# EAGLE board demo_open8 (EAGLE 9.6.2), part 1 of 2
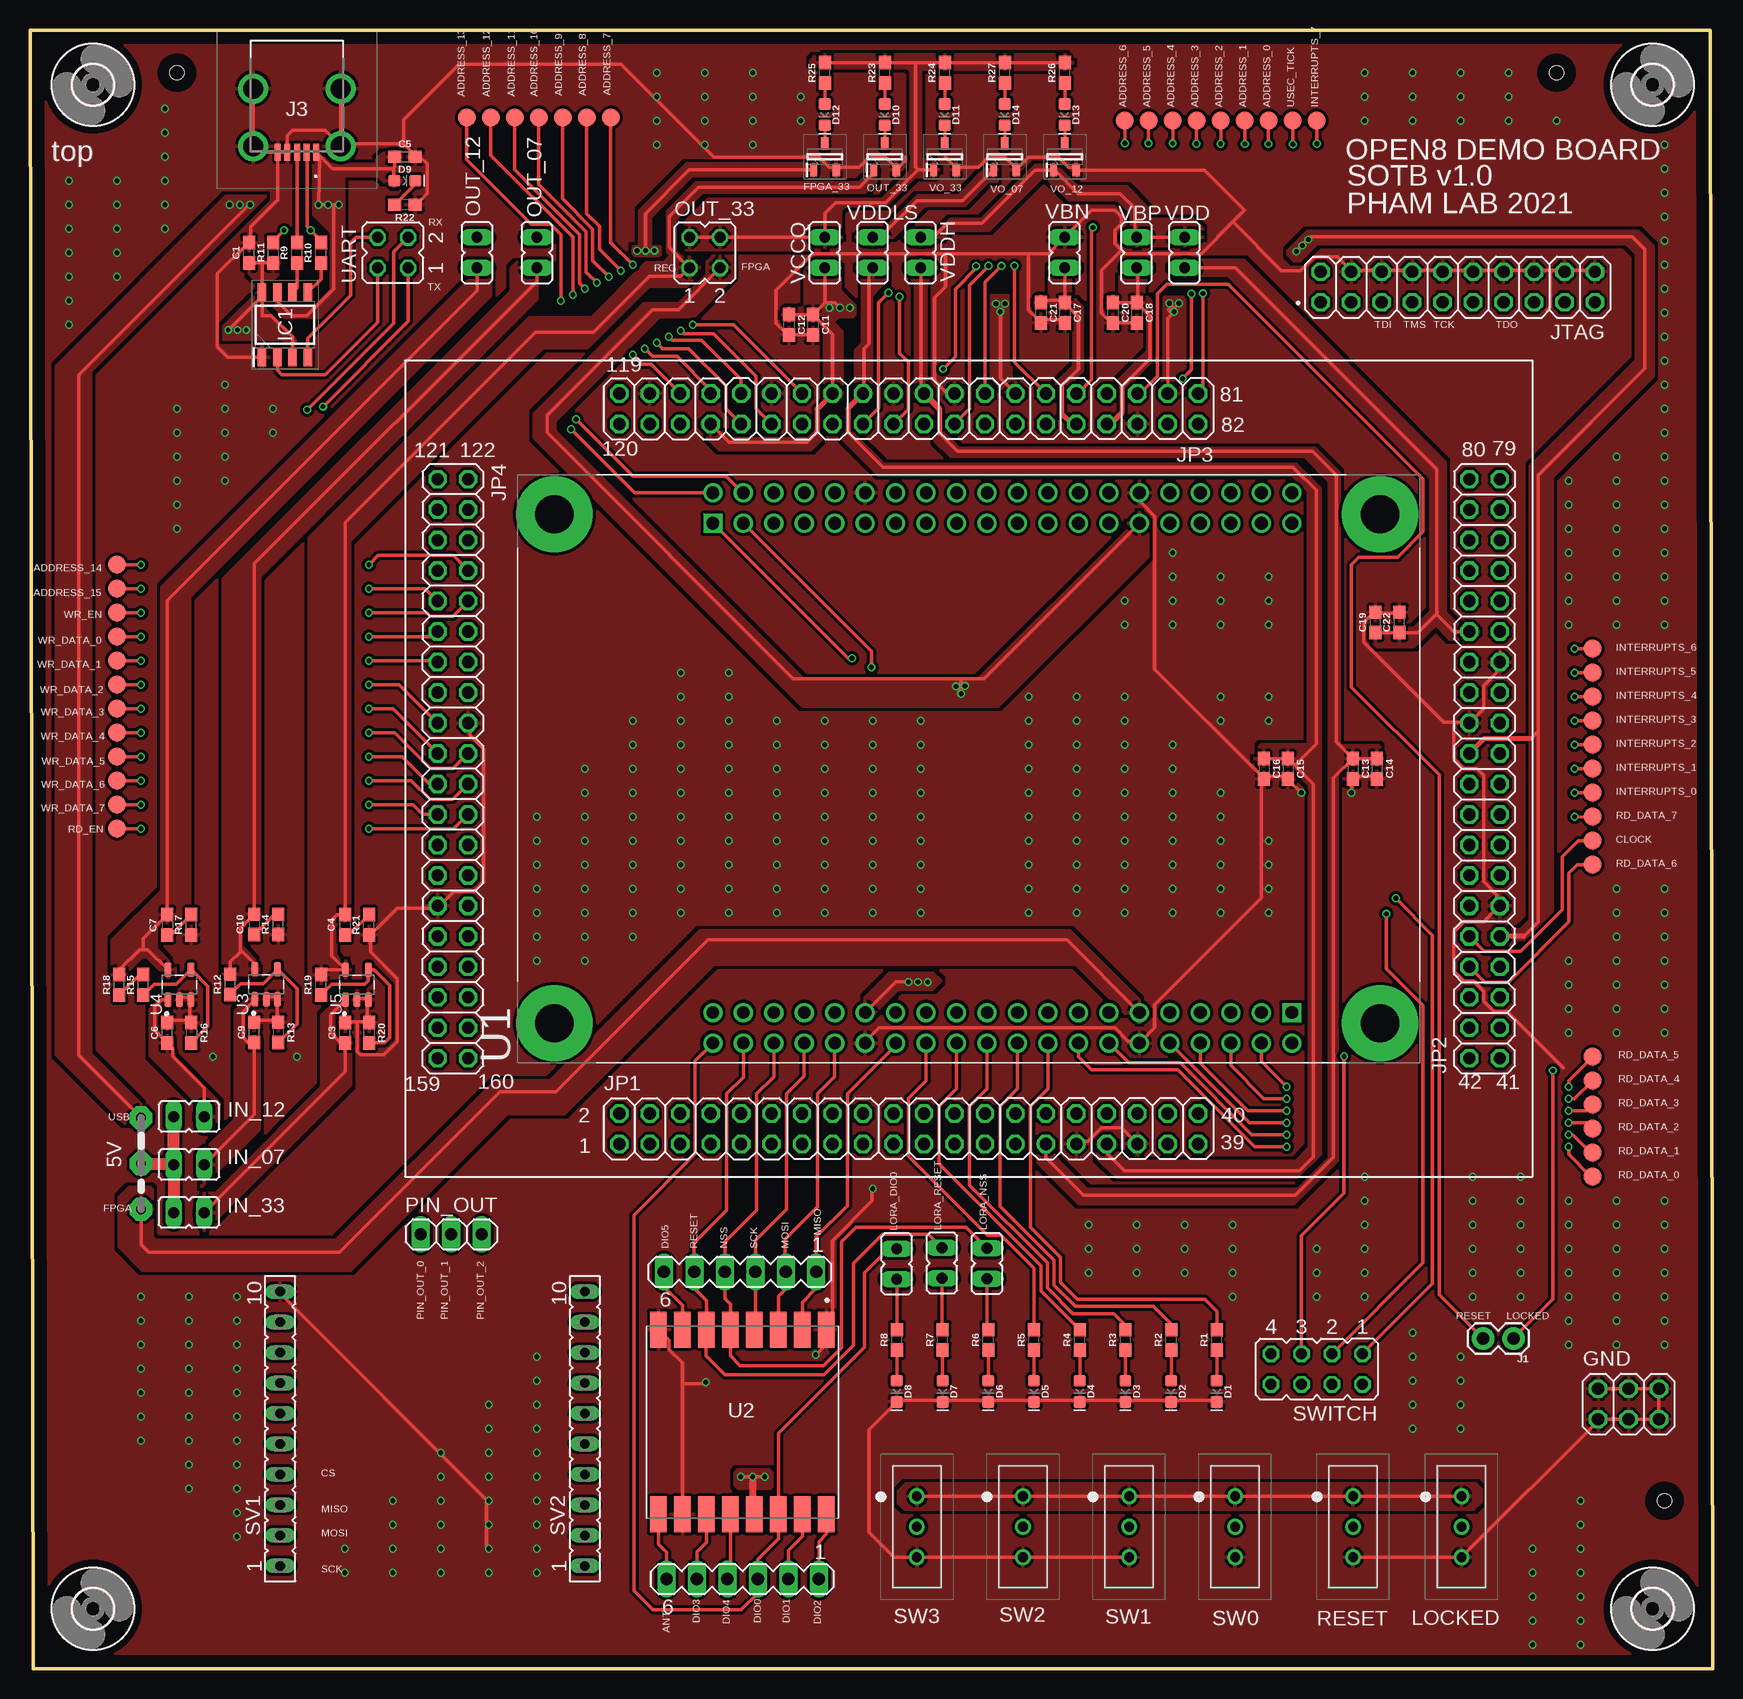
[diagram p2: board, top side]
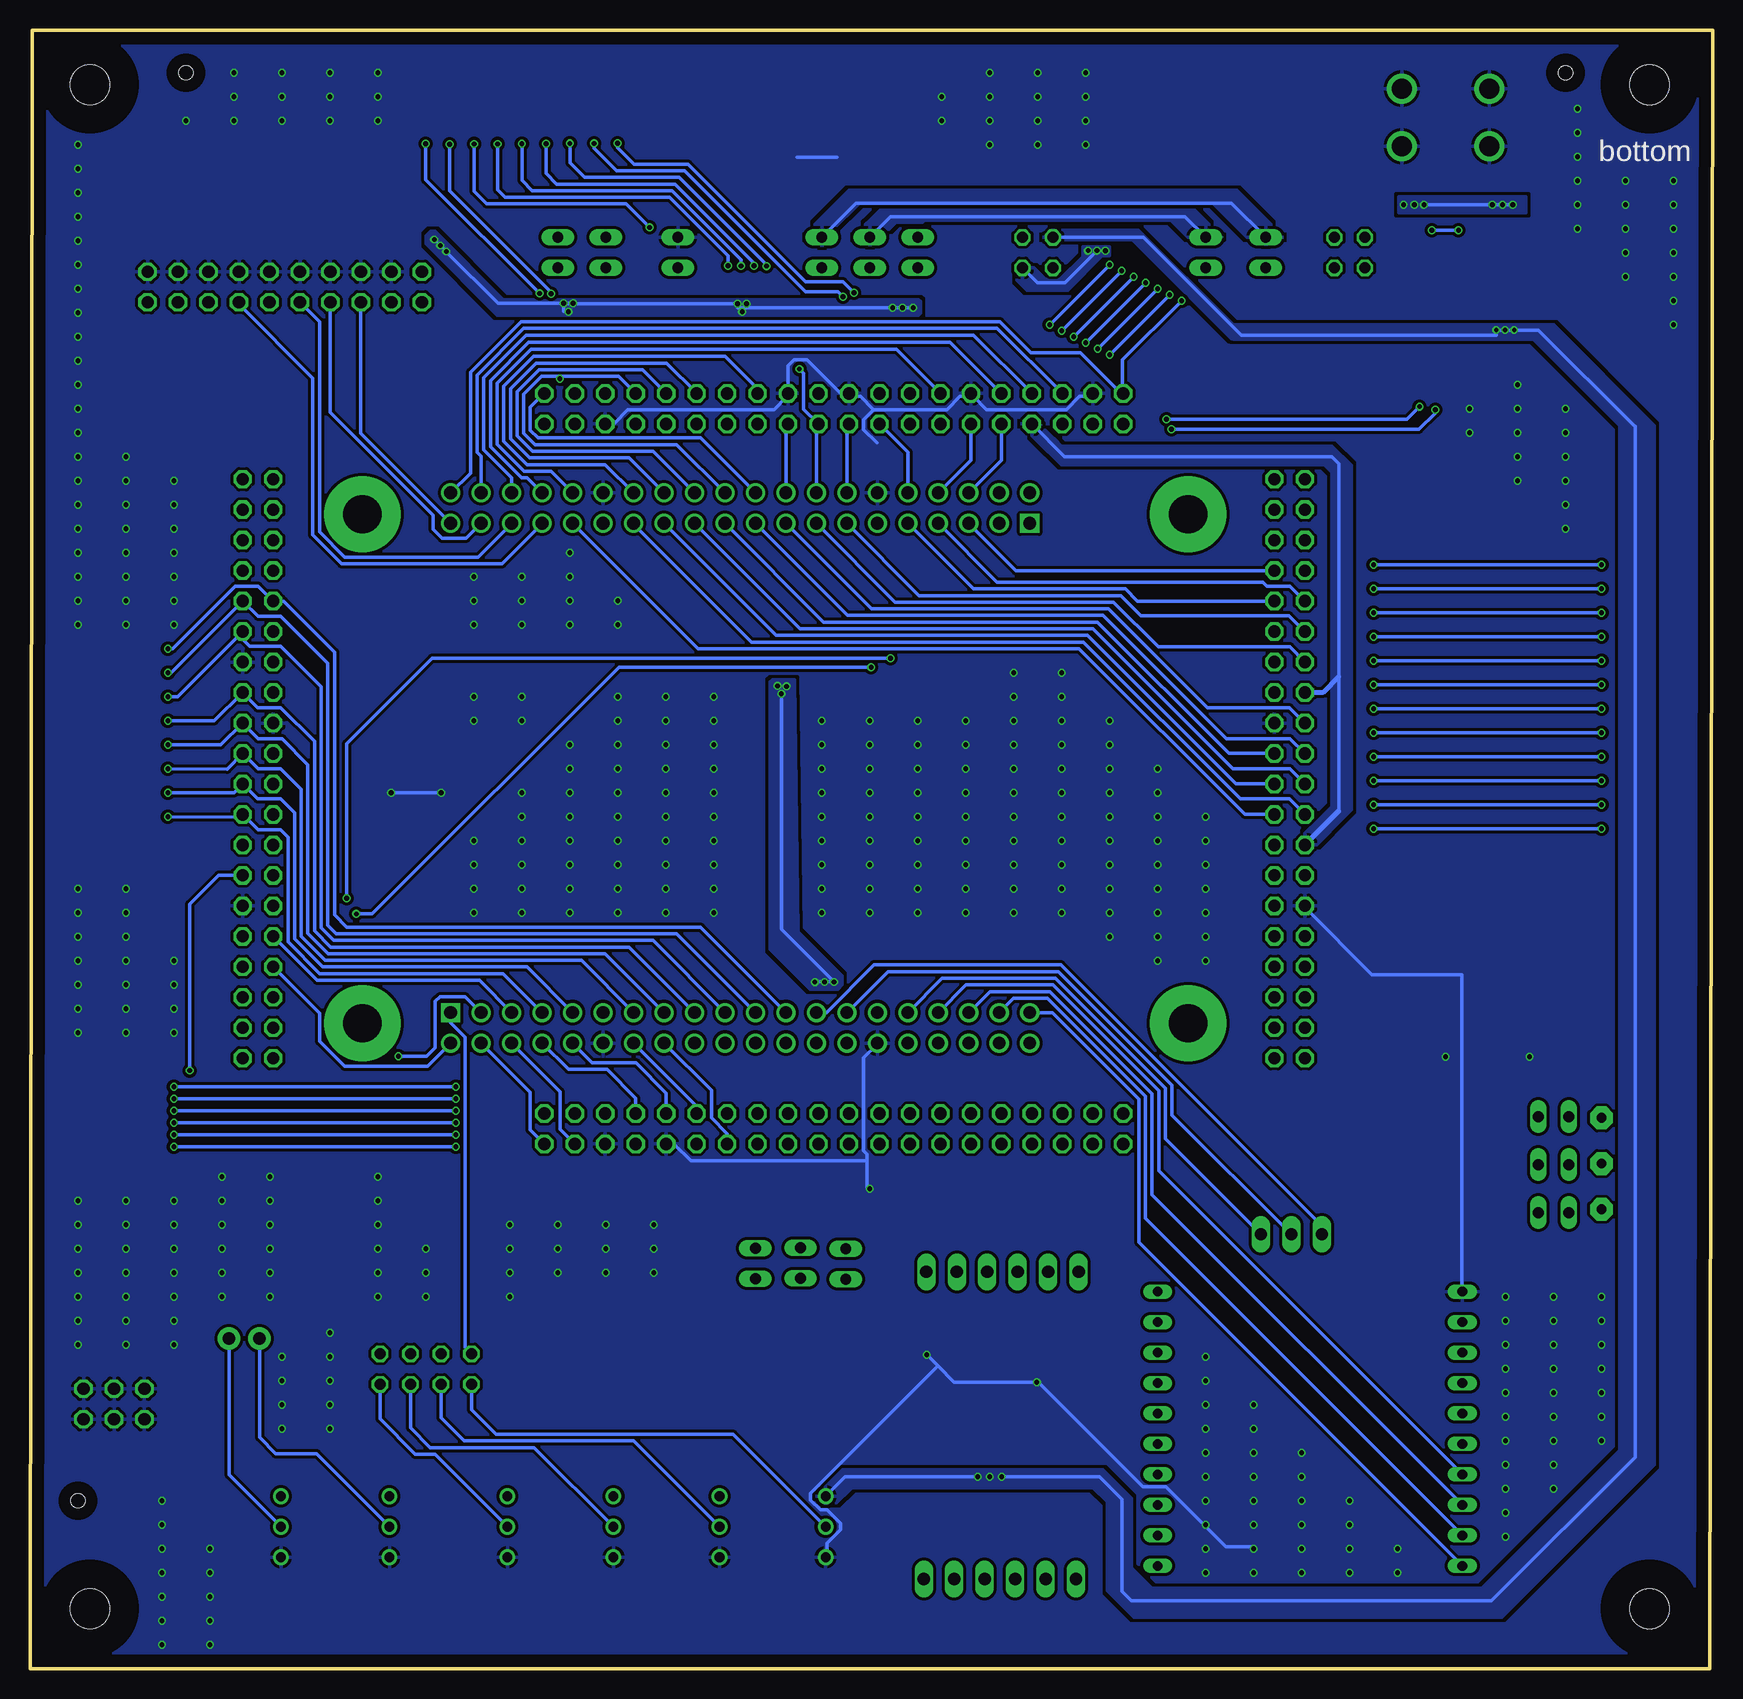
[diagram p3: board, bottom side, seen from below]

Size 140.25 x 136.56 mm. Coordinates in mm from the lower left corner, seen from the top.
Outline: 140.05,136.52 0,136.56 0.25,0 140.25,0 140.05,136.52
Copper layers (1*16): Top 0.035mm / dielectric 1.5mm / Bottom 0.035mm
Design rules "default *": minimum track width 0.3mm, minimum drill 0.35mm, track to track 10mil, track to pad 10mil, pad to pad 10mil, via to via 10mil, smd to smd 10mil, copper to edge 40mil, drill to drill 6mil, minimum pad ring 0.13mm, minimum via ring 0.13mm, stop-mask expansion 4mil, vias tented up to drill 0mil, thermal gap 10mil
Holes 1.15 mm at 127.25,133 12.25,133 136.25,14

## Footprints (pad centres in the part's own frame; a part is rotated, then mirrored left to right if it is on the bottom)
04C = drill 0.813 pad 1.905 octagon: 1 -1.905,0; 2 1.905,0; 3 5.715,0
POINT = smd 1.5 x 1.5: 1 0,0
0603 = smd 1.1 x 1: 1 -0.85,0; 2 0.85,0
LED-0603 = smd 1 x 1: A -0.877,0; C 0.877,0
SOT95P230X110-3N = smd 1.05 x 0.6: 1 -1.1,0.95; 2 -1.1,-0.95; 3 1.1,0
2X03 = drill 1.016 octagon: 1 -2.54,-1.27; 2 -2.54,1.27; 3 0,-1.27; 4 0,1.27; 5 2.54,-1.27; 6 2.54,1.27
3,3 = hole 3.3: 0,0
SOIC127P600X170-8N = smd 1.525 x 0.7: 1 -2.712,1.905; 2 -2.712,0.635; 3 -2.712,-0.635; 4 -2.712,-1.905; 5 2.712,-1.905; 6 2.712,-0.635; 7 2.712,0.635; 8 2.712,1.905
JP1 = drill 0.914 long: 1 0,-1.27; 2 0,1.27
1X02 = drill 1.016 pad 1.88: 1 0,0; 2 2.54,0
UMM5DDW1 = smd 0.5 x 1.4: 1 -1.6,3.625; 2 -0.8,3.625; 3 0,3.625; 4 0.8,3.625; 5 1.6,3.625 | drill 1.68 pad 2.5: MH1 -3.65,-1.675; MH2 3.65,-1.675; MH3 3.65,3.125; MH4 -3.65,3.125
2X20 = drill 1.016 octagon: 1 -24.13,-1.27; 2 -24.13,1.27; 3 -21.59,-1.27; 4 -21.59,1.27; 5 -19.05,-1.27; 6 -19.05,1.27; 7 -16.51,-1.27; 8 -16.51,1.27; 9 -13.97,-1.27; 10 -13.97,1.27; 11 -11.43,-1.27; 12 -11.43,1.27; 13 -8.89,-1.27; 14 -8.89,1.27; 15 -6.35,-1.27; 16 -6.35,1.27; 17 -3.81,-1.27; 18 -3.81,1.27; 19 -1.27,-1.27; 20 -1.27,1.27; 21 1.27,-1.27; 22 1.27,1.27; 23 3.81,-1.27; 24 3.81,1.27; 25 6.35,-1.27; 26 6.35,1.27; 27 8.89,-1.27; 28 8.89,1.27; 29 11.43,-1.27; 30 11.43,1.27; 31 13.97,-1.27; 32 13.97,1.27; 33 16.51,-1.27; 34 16.51,1.27; 35 19.05,-1.27; 36 19.05,1.27; 37 21.59,-1.27; 38 21.59,1.27; 39 24.13,-1.27; 40 24.13,1.27
2X10 = drill 1.016 octagon: 1 -11.43,-1.27; 2 -11.43,1.27; 3 -8.89,-1.27; 4 -8.89,1.27; 5 -6.35,-1.27; 6 -6.35,1.27; 7 -3.81,-1.27; 8 -3.81,1.27; 9 -1.27,-1.27; 10 -1.27,1.27; 11 1.27,-1.27; 12 1.27,1.27; 13 3.81,-1.27; 14 3.81,1.27; 15 6.35,-1.27; 16 6.35,1.27; 17 8.89,-1.27; 18 8.89,1.27; 19 11.43,-1.27; 20 11.43,1.27
SS12SDP2 = drill 0.8 pad 1.3: 1 0,2.54; 2 0,0; 3 0,-2.54
JP2Q = drill 0.914 octagon: 1 -1.27,-1.27; 2 -1.27,1.27; 3 1.27,-1.27; 4 1.27,1.27
1X03 = drill 1.016 long: 1 -2.54,0; 2 0,0; 3 2.54,0
FE10 = drill 0.813 long: 1 -11.43,0; 2 -8.89,0; 3 -6.35,0; 4 -3.81,0; 5 -1.27,0; 6 1.27,0; 7 3.81,0; 8 6.35,0; 9 8.89,0; 10 11.43,0
MA06-1 = drill 1.016 long: 1 -6.35,0; 2 -3.81,0; 3 -1.27,0; 4 1.27,0; 5 3.81,0; 6 6.35,0
JP4Q = drill 0.914 octagon: 1 -3.81,-1.27; 2 -3.81,1.27; 3 -1.27,-1.27; 4 -1.27,1.27; 5 1.27,-1.27; 6 1.27,1.27; 7 3.81,-1.27; 8 3.81,1.27
MODULE_P0082_BOTTOMMOUNT = drill 1.06 square: JP1_1 20.45,21.33; JP2_1 -20.32,-26.93 | drill 1.06: JP1_2 22.99,21.33; JP1_3 20.45,18.79; JP1_4 22.99,18.79; JP1_5 20.45,16.25; JP1_6 22.99,16.25; JP1_7 20.45,13.71; JP1_8 22.99,13.71; JP1_9 20.45,11.17; JP1_10 22.99,11.17; JP1_11 20.45,8.63; JP1_12 22.99,8.63; JP1_13 20.45,6.09; JP1_14 22.99,6.09; JP1_15 20.45,3.55; JP1_16 22.99,3.55; JP1_17 20.45,1.01; JP1_18 22.99,1.01; JP1_19 20.45,-1.53; JP1_20 22.99,-1.53; JP1_21 20.45,-4.07; JP1_22 22.99,-4.07; JP1_23 20.45,-6.61; JP1_24 22.99,-6.61; JP1_25 20.45,-9.15; JP1_26 22.99,-9.15; JP1_27 20.45,-11.69; JP1_28 22.99,-11.69; JP1_29 20.45,-14.23; JP1_30 22.99,-14.23; JP1_31 20.45,-16.77; JP1_32 22.99,-16.77; JP1_33 20.45,-19.31; JP1_34 22.99,-19.31; JP1_35 20.45,-21.85; JP1_36 22.99,-21.85; JP1_37 20.45,-24.39; JP1_38 22.99,-24.39; JP1_39 20.45,-26.93; JP1_40 22.99,-26.93; JP2_2 -22.86,-26.93; JP2_3 -20.32,-24.39; JP2_4 -22.86,-24.39; JP2_5 -20.32,-21.85; JP2_6 -22.86,-21.85; JP2_7 -20.32,-19.31; JP2_8 -22.86,-19.31; JP2_9 -20.32,-16.77; JP2_10 -22.86,-16.77; JP2_11 -20.32,-14.23; JP2_12 -22.86,-14.23; JP2_13 -20.32,-11.69; JP2_14 -22.86,-11.69; JP2_15 -20.32,-9.15; JP2_16 -22.86,-9.15; JP2_17 -20.32,-6.61; JP2_18 -22.86,-6.61; JP2_19 -20.32,-4.07; JP2_20 -22.86,-4.07; JP2_21 -20.32,-1.53; JP2_22 -22.86,-1.53; JP2_23 -20.32,1.01; JP2_24 -22.86,1.01; JP2_25 -20.32,3.55; JP2_26 -22.86,3.55; JP2_27 -20.32,6.09; JP2_28 -22.86,6.09; JP2_29 -20.32,8.63; JP2_30 -22.86,8.63; JP2_31 -20.32,11.17; JP2_32 -22.86,11.17; JP2_33 -20.32,13.71; JP2_34 -22.86,13.71; JP2_35 -20.32,16.25; JP2_36 -22.86,16.25; JP2_37 -20.32,18.79; JP2_38 -22.86,18.79; JP2_39 -20.32,21.33; JP2_40 -22.86,21.33 | drill 3.2 pad 6.35: S1 -21.21,34.54; S2 21.21,34.54; S3 -21.21,-34.29; S4 21.21,-34.29
XCVR_RFM95W-915S2 = smd 3 x 1.4: 1 -7.7,7; 2 -7.7,5; 3 -7.7,3; 4 -7.7,1; 5 -7.7,-1; 6 -7.7,-3; 7 -7.7,-5; 8 -7.7,-7; 9 7.7,-7; 10 7.7,-5; 11 7.7,-3; 12 7.7,-1; 13 7.7,1; 14 7.7,3; 15 7.7,5; 16 7.7,7
SOT95P280X145-5N = smd 1.21 x 0.59: 1 -1.255,0.95; 2 -1.255,0; 3 -1.255,-0.95; 4 1.255,-0.95; 5 1.255,0.95

## Placement (x,y rotation side)
5V  JUMPER_IN_50  [04C]  9.25,44 270 top
ADDRESS_0  [POINT]  103.25,129 180 top
ADDRESS_1  [POINT]  101.25,129 180 top
ADDRESS_2  [POINT]  99.25,129 180 top
ADDRESS_3  [POINT]  97.25,129 180 top
ADDRESS_4  [POINT]  95.25,129 180 top
ADDRESS_5  [POINT]  93.25,129 180 top
ADDRESS_6  [POINT]  91.25,129 180 top
ADDRESS_7  [POINT]  48.4,129.27 180 top
ADDRESS_8  [POINT]  46.4,129.27 180 top
ADDRESS_9  [POINT]  44.4,129.27 180 top
ADDRESS_10  [POINT]  42.4,129.27 180 top
ADDRESS_11  [POINT]  40.4,129.27 180 top
ADDRESS_12  [POINT]  38.4,129.27 180 top
ADDRESS_13  [POINT]  36.4,129.27 180 top
ADDRESS_14  [POINT]  7.25,92 270 top
ADDRESS_15  [POINT]  7.25,90 270 top
C1  1.0uF  [0603]  18.25,118 90 top
C3  1.0uF  [0603]  26.25,53 90 top
C4  4.7uF  [0603]  26.25,62 270 top
C5  10uF  [0603]  31.25,126 0 top
C6  1.0uF  [0603]  11.45,53 90 top
C7  4.7uF  [0603]  11.45,62 270 top
C9  1.0uF  [0603]  18.69,53.03 90 top
C10  4.7uF  [0603]  18.69,62.03 270 top
C11  10uF  [0603]  65.25,112 270 top
C12  0.1uF  [0603]  63.25,112 270 top
C13  10uF  [0603]  110.27,75 270 top
C14  0.1uF  [0603]  112.27,75 270 top
C15  10uF  [0603]  104.85,75 270 top
C16  0.1uF  [0603]  102.85,75 270 top
C17  0.1uF  [0603]  86.25,113 270 top
C18  0.1uF  [0603]  92.25,113 270 top
C19  0.1uF  [0603]  112.15,87.2 90 top
C20  10uF  [0603]  90.25,113 270 top
C21  10uF  [0603]  84.25,113 270 top
C22  10uF  [0603]  114.15,87.2 90 top
CLOCK  [POINT]  130.25,69 0 top
D1  LED0  [LED-0603]  98.93,23.12 270 top
D2  LED1  [LED-0603]  95.12,23.12 270 top
D3  LED2  [LED-0603]  91.31,23.12 270 top
D4  LED3  [LED-0603]  87.5,23.12 270 top
D5  LED4  [LED-0603]  83.69,23.12 270 top
D6  LED5  [LED-0603]  79.88,23.12 270 top
D7  LED6  [LED-0603]  76.07,23.12 270 top
D8  LED7  [LED-0603]  72.26,23.12 270 top
D9  POWER LED  [LED-0603]  31.25,124 0 top
D10  LED0  [LED-0603]  71.25,129.5 270 top
D11  LED0  [LED-0603]  76.25,129.5 270 top
D12  LED0  [LED-0603]  66.25,129.5 270 top
D13  LED0  [LED-0603]  86.25,129.5 270 top
D14  LED0  [LED-0603]  81.25,129.5 270 top
FPGA_33  BSH103,235  [SOT95P230X110-3N]  66.25,126 90 top
GND  GND  [2X03]  133.25,22.06 0 top
H1  MOUNT-HOLE3.3  [3,3]  135.25,132 0 top
H2  MOUNT-HOLE3.3  [3,3]  5.25,5 0 top
H3  MOUNT-HOLE3.3  [3,3]  5.25,132 0 top
H4  MOUNT-HOLE3.3  [3,3]  135.25,5 0 top
IC1  PL2303SA__LF  [SOIC127P600X170-8N]  21.25,112 90 top
IN_07  REG_IN_07  [JP1]  13.25,42 270 top
IN_12  REG_IN_12  [JP1]  13.25,46 270 top
IN_33  REG_IN_33  [JP1]  13.25,38 270 top
INTERRUPTS_6  INTERRUPTS_6  [POINT]  130.25,85 90 top
J1  [1X02]  123.66,27.52 180 top
J3  U-M-M5DD-W-1  [UMM5DDW1]  22.25,130 180 top
JP1  [2X20]  73.25,45 0 top
JP2  [2X20]  121.25,75 90 top
JP3  [2X20]  73.25,105 180 top
JP4  [2X20]  35.25,75 270 top
JTAG  JTAG PIN  [2X10]  119.02,115.14 0 top
LOCKED  SS12SDP2  [SS12SDP2]  119.33,11.83 0 top
LORA_DIO0  [JP1]  72.25,33.73 180 top
LORA_NSS  [JP1]  79.79,33.77 180 top
LORA_RESET  [JP1]  76.02,33.81 180 top
OUT_07  REG_OUT_07  [JP1]  42.25,118 0 top
OUT_12  REG_OUT_12  [JP1]  37.25,118 0 top
OUT_33  [JP2Q]  56.25,118 0 top
PIN_OUT  PIN_OUT  [1X03]  35.11,36.2 0 top
Q1  BSH103,235  [SOT95P230X110-3N]  71.25,126 90 top
Q2  BSH103,235  [SOT95P230X110-3N]  76.25,126 90 top
Q4  BSH103,235  [SOT95P230X110-3N]  86.25,126 90 top
Q5  BSH103,235  [SOT95P230X110-3N]  81.25,126 90 top
R1  330  [0603]  98.94,27.41 90 top
R2  330  [0603]  95.13,27.41 90 top
R3  330  [0603]  91.32,27.41 90 top
R4  330  [0603]  87.51,27.41 90 top
R5  330  [0603]  83.7,27.41 90 top
R6  330  [0603]  79.89,27.41 90 top
R7  330  [0603]  76.08,27.41 90 top
R8  330  [0603]  72.27,27.41 90 top
R9  27  [0603]  22.25,118 90 top
R10  27  [0603]  24.25,118 90 top
R11  1.5k  [0603]  20.25,118 270 top
R12  3.3k  [0603]  16.69,57.03 90 top
R13  62KOHM-0603-1/10W-5%  [0603]  20.69,53.03 270 top
R14  1  [0603]  20.69,62.03 90 top
R15  43k  [0603]  9.45,57 90 top
R16  62KOHM-0603-1/10W-5%  [0603]  13.45,53 270 top
R17  1  [0603]  13.45,62 90 top
R18  10k  [0603]  7.45,57 90 top
R19  240  [0603]  24.25,57 90 top
R20  62KOHM-0603-1/10W-5%  [0603]  28.25,53 270 top
R21  1  [0603]  28.25,62 90 top
R22  330  [0603]  31.25,122 180 top
R23  330  [0603]  71.25,133 90 top
R24  330  [0603]  76.25,133 90 top
R25  330  [0603]  66.25,133 90 top
R26  330  [0603]  86.25,133 90 top
R27  330  [0603]  81.25,133 90 top
RD_DATA_0  [POINT]  130.25,41 90 top
RD_DATA_2  [POINT]  130.25,45 90 top
RD_DATA_3  [POINT]  130.25,47 90 top
RD_DATA_4  [POINT]  130.25,49 90 top
RD_DATA_5  [POINT]  130.25,51 90 top
RD_DATA_6  [POINT]  130.25,67 90 top
RD_DATA_7  [POINT]  130.25,71 0 top
RD_EN  [POINT]  7.25,70 270 top
RESET  SS12SDP2  [SS12SDP2]  110.29,11.83 0 top
SV1  SPI0  [FE10]  20.85,20 90 top
SV2  SPI1  [FE10]  46.25,20 90 top
SV3  [MA06-1]  59.19,33.07 180 top
SV4  [MA06-1]  59.4,7.47 180 top
SW0  SS12SDP2  [SS12SDP2]  100.45,11.83 0 top
SW1  SS12SDP2  [SS12SDP2]  91.61,11.83 0 top
SW2  SS12SDP2  [SS12SDP2]  82.77,11.83 0 top
SW3  SS12SDP2  [SS12SDP2]  73.93,11.83 0 top
SWITCH  SWITCH  [JP4Q]  107.26,24.97 180 top
U1  P0082  [MODULE_P0082_BOTTOMMOUNT]  78.25,75 90 top
U2  RFM95W-915S2  [XCVR_RFM95W-915S2]  59.38,20.56 270 top
U3  TPS76201DBVR  [SOT95P280X145-5N]  19.69,57.03 90 top
U4  TPS76201DBVR  [SOT95P280X145-5N]  12.45,57 90 top
U5  TPS76201DBVR  [SOT95P280X145-5N]  27.25,57 90 top
U$4  [POINT]  130.25,43 90 top
U$10  INTERRUPTS_0  [POINT]  130.25,73 90 top
U$11  INTERRUPTS_1  [POINT]  130.25,75 90 top
U$12  INTERRUPTS_2  [POINT]  130.25,77 90 top
U$13  INTERRUPTS_3  [POINT]  130.25,79 90 top
U$14  INTERRUPTS_5  [POINT]  130.25,81 90 top
U$15  INTERRUPTS_5  [POINT]  130.25,83 90 top
U$17  INTERRUPTS_7  [POINT]  107.25,129 0 top
U$40  [POINT]  7.25,74 270 top
UART  UART  [JP2Q]  30.25,118 90 top
USEC_TICK  [POINT]  105.25,129 0 top
VBN  VBN  [JP1]  86.25,118 180 top
VBP  VBP  [JP1]  92.25,118 180 top
VCCQ  VCCQ  [JP1]  66.25,118 180 top
VDD  VDD  [JP1]  96.25,118 180 top
VDDH  VDDH  [JP1]  74.25,118 180 top
VDDLS  VDDLS  [JP1]  70.25,118 180 top
WR_DATA_0  [POINT]  7.25,86 270 top
WR_DATA_1  [POINT]  7.25,84 270 top
WR_DATA_2  [POINT]  7.25,82 270 top
WR_DATA_3  [POINT]  7.25,80 270 top
WR_DATA_4  [POINT]  7.25,78 270 top
WR_DATA_5  [POINT]  7.25,76 270 top
WR_DATA_7  [POINT]  7.25,72 270 top
WR_EN  [POINT]  7.25,88 0 top